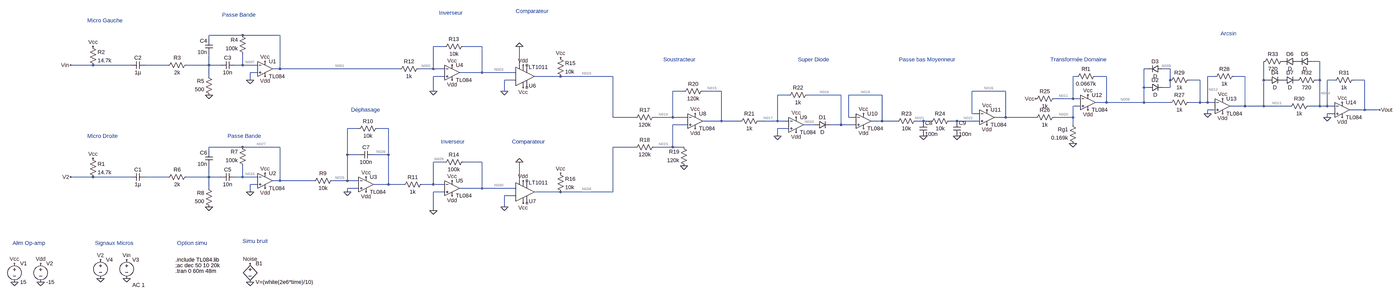
[diagram p0: schematic Récepteur.asc, whole sheet]
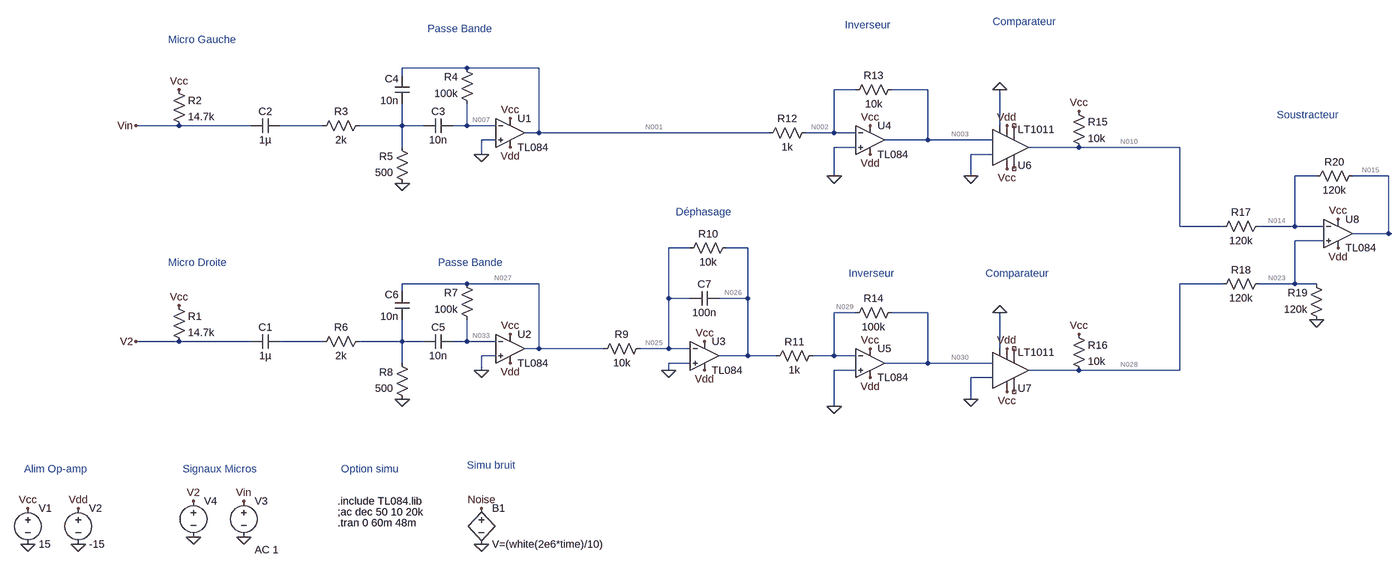
[diagram p1: schematic Récepteur.asc, part, row 1 of 1, column 1 of 2]
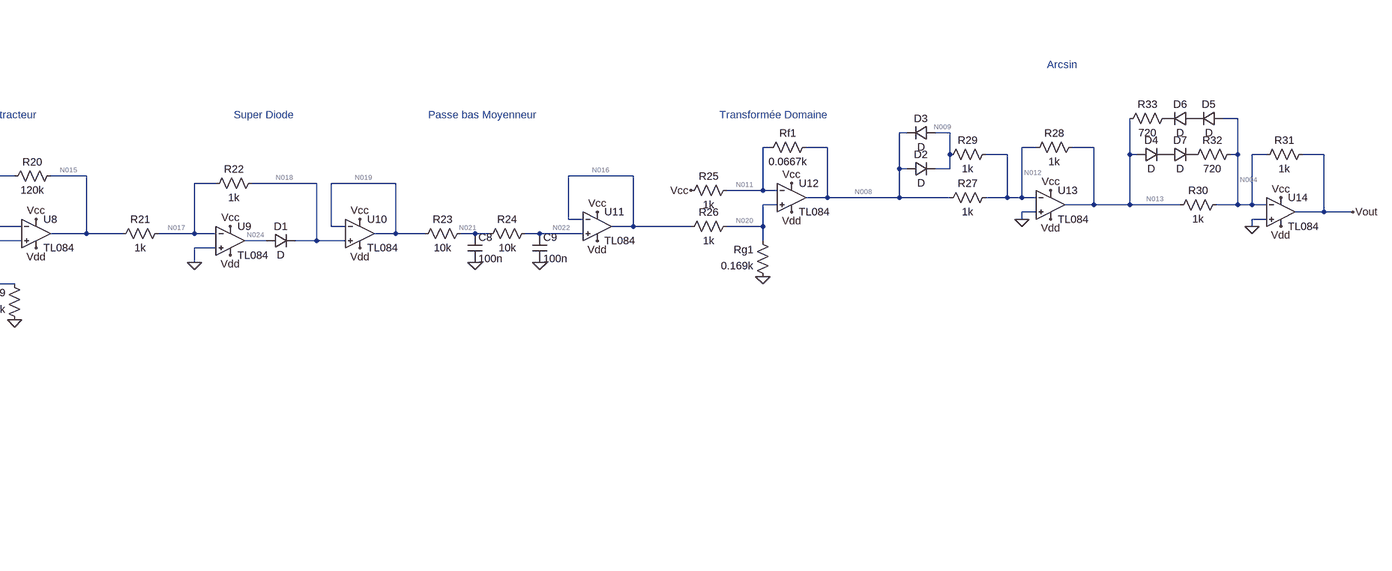
[diagram p2: schematic Récepteur.asc, part, row 1 of 1, column 2 of 2]
Récepteur.asc, the LTspice schematic file:
Version 4
SHEET 1 5480 844
WIRE 480 -368 336 -368
WIRE 640 -368 480 -368
WIRE 336 -352 336 -368
WIRE 1344 -320 1296 -320
WIRE 1504 -320 1424 -320
WIRE 5088 -256 5056 -256
WIRE -160 -240 -256 -240
WIRE 0 -240 -160 -240
WIRE 160 -240 64 -240
WIRE 336 -240 336 -288
WIRE 336 -240 240 -240
WIRE 384 -240 336 -240
WIRE 480 -240 480 -288
WIRE 480 -240 448 -240
WIRE 544 -240 480 -240
WIRE 1664 -240 1664 -320
WIRE 640 -224 640 -368
WIRE 640 -224 608 -224
WIRE 1152 -224 640 -224
WIRE 1296 -224 1296 -320
WIRE 1296 -224 1232 -224
WIRE 1344 -224 1296 -224
WIRE 4352 -224 4336 -224
WIRE 4448 -224 4416 -224
WIRE 544 -208 512 -208
WIRE 1504 -208 1504 -320
WIRE 1504 -208 1408 -208
WIRE 1648 -208 1504 -208
WIRE 336 -192 336 -240
WIRE 1344 -192 1296 -192
WIRE 1840 -192 1728 -192
WIRE 2064 -192 1840 -192
WIRE 4048 -192 4032 -192
WIRE 4176 -192 4128 -192
WIRE 4640 -192 4608 -192
WIRE 4768 -192 4720 -192
WIRE 512 -176 512 -208
WIRE 1648 -176 1600 -176
WIRE 4448 -176 4448 -224
WIRE 4576 -176 4528 -176
WIRE 4848 -176 4848 -256
WIRE 4864 -176 4848 -176
WIRE 5088 -176 5088 -256
WIRE 5088 -176 5072 -176
WIRE 5152 -176 5120 -176
WIRE 5280 -176 5232 -176
WIRE 4336 -144 4336 -224
WIRE 4352 -144 4336 -144
WIRE 4448 -144 4448 -176
WIRE 4448 -144 4416 -144
WIRE 1296 -128 1296 -192
WIRE 1600 -128 1600 -176
WIRE 2368 -128 2320 -128
WIRE 2528 -128 2448 -128
WIRE 3744 -128 3600 -128
WIRE 2816 -112 2768 -112
WIRE 3040 -112 2896 -112
WIRE 3216 -112 3072 -112
WIRE 4032 -96 4032 -192
WIRE 4032 -96 3952 -96
WIRE 4064 -96 4032 -96
WIRE 4176 -80 4176 -192
WIRE 4176 -80 4128 -80
WIRE 4336 -80 4336 -144
WIRE 4336 -80 4176 -80
WIRE 4448 -80 4336 -80
WIRE 4576 -80 4576 -176
WIRE 4576 -80 4528 -80
WIRE 4608 -80 4608 -192
WIRE 4608 -80 4576 -80
WIRE 4640 -80 4608 -80
WIRE 4064 -64 4032 -64
WIRE 4768 -64 4768 -192
WIRE 4768 -64 4704 -64
WIRE 4848 -64 4848 -176
WIRE 4848 -64 4768 -64
WIRE 4960 -64 4848 -64
WIRE 5088 -64 5088 -176
WIRE 5088 -64 5040 -64
WIRE 5120 -64 5120 -176
WIRE 5120 -64 5088 -64
WIRE 5152 -64 5120 -64
WIRE 4640 -48 4608 -48
WIRE 5280 -48 5280 -176
WIRE 5280 -48 5216 -48
WIRE 5344 -48 5280 -48
WIRE 3600 -32 3600 -128
WIRE 3632 -32 3600 -32
WIRE 4608 -32 4608 -48
WIRE 5152 -32 5120 -32
WIRE 2064 -16 2064 -192
WIRE 2160 -16 2064 -16
WIRE 2320 -16 2320 -128
WIRE 2320 -16 2240 -16
WIRE 2384 -16 2320 -16
WIRE 3072 -16 3072 -112
WIRE 3104 -16 3072 -16
WIRE 3744 -16 3744 -128
WIRE 3744 -16 3696 -16
WIRE 3872 -16 3744 -16
WIRE 4032 -16 4032 -64
WIRE 4032 -16 3952 -16
WIRE 5120 -16 5120 -32
WIRE 2528 0 2528 -128
WIRE 2528 0 2448 0
WIRE 2608 0 2528 0
WIRE 2768 0 2768 -112
WIRE 2768 0 2688 0
WIRE 2816 0 2768 0
WIRE 3216 0 3216 -112
WIRE 3216 0 3168 0
WIRE 3280 0 3216 0
WIRE 3392 0 3360 0
WIRE 3424 0 3392 0
WIRE 3536 0 3504 0
WIRE 3632 0 3536 0
WIRE 2384 16 2320 16
WIRE 2928 16 2880 16
WIRE 3040 16 3040 -112
WIRE 3040 16 2992 16
WIRE 3104 16 3040 16
WIRE 4032 16 4032 -16
WIRE 976 32 928 32
WIRE 1104 32 1056 32
WIRE 2816 32 2768 32
WIRE 2768 64 2768 32
WIRE 480 112 336 112
WIRE 640 112 480 112
WIRE 2160 112 2064 112
WIRE 2320 112 2320 16
WIRE 2320 112 2240 112
WIRE 2368 112 2320 112
WIRE 336 128 336 112
WIRE 928 144 928 32
WIRE 976 144 928 144
WIRE 1104 144 1104 32
WIRE 1104 144 1040 144
WIRE 1344 176 1296 176
WIRE 1504 176 1424 176
WIRE -160 240 -256 240
WIRE 0 240 -160 240
WIRE 160 240 64 240
WIRE 336 240 336 192
WIRE 336 240 240 240
WIRE 384 240 336 240
WIRE 480 240 480 192
WIRE 480 240 448 240
WIRE 544 240 480 240
WIRE 640 256 640 112
WIRE 640 256 608 256
WIRE 784 256 640 256
WIRE 928 256 928 144
WIRE 928 256 864 256
WIRE 976 256 928 256
WIRE 1664 256 1664 176
WIRE 544 272 512 272
WIRE 1104 272 1104 144
WIRE 1104 272 1040 272
WIRE 1168 272 1104 272
WIRE 1296 272 1296 176
WIRE 1296 272 1248 272
WIRE 1344 272 1296 272
WIRE 336 288 336 240
WIRE 976 288 928 288
WIRE 1504 288 1504 176
WIRE 1504 288 1408 288
WIRE 1648 288 1504 288
WIRE 512 304 512 272
WIRE 928 304 928 288
WIRE 1344 304 1296 304
WIRE 1840 304 1728 304
WIRE 2064 304 2064 112
WIRE 2064 304 1840 304
WIRE 1648 320 1600 320
WIRE 1600 368 1600 320
WIRE 1296 384 1296 304
FLAG -16 800 0
FLAG -496 816 0
FLAG -384 816 0
FLAG -384 736 Vdd
FLAG -496 736 Vcc
FLAG -16 720 Vin
FLAG 512 816 0
FLAG 512 736 Noise
FLAG -128 800 0
FLAG -128 720 V2
FLAG -160 -320 Vcc
FLAG -160 160 Vcc
FLAG 512 -176 0
FLAG 576 -256 Vcc
FLAG 576 -192 Vdd
FLAG 336 -112 0
FLAG 512 304 0
FLAG 576 224 Vcc
FLAG 576 288 Vdd
FLAG 336 368 0
FLAG 1008 240 Vcc
FLAG 1008 304 Vdd
FLAG 928 304 0
FLAG 1296 384 0
FLAG 1376 256 Vcc
FLAG 1376 -240 Vcc
FLAG 1376 -176 Vdd
FLAG 1376 320 Vdd
FLAG 1296 -128 0
FLAG 1600 -128 0
FLAG 1664 -320 0
FLAG 1680 -144 Vcc
FLAG 1680 -240 Vdd
FLAG 1840 -272 Vcc
FLAG 1600 368 0
FLAG 1664 176 0
FLAG 1680 352 Vcc
FLAG 1680 256 Vdd
FLAG 1840 224 Vcc
FLAG 2416 -32 Vcc
FLAG 2416 32 Vdd
FLAG 2368 192 0
FLAG 2848 -16 Vcc
FLAG 2848 48 Vdd
FLAG 2768 64 0
FLAG 3136 -32 Vcc
FLAG 3136 32 Vdd
FLAG 3392 64 0
FLAG 3536 64 0
FLAG 3664 -48 Vcc
FLAG 3664 16 Vdd
FLAG 4096 -112 Vcc
FLAG 4096 -48 Vdd
FLAG 3872 -96 Vcc
FLAG 4032 96 0
FLAG 4608 -32 0
FLAG 4672 -96 Vcc
FLAG 4672 -32 Vdd
FLAG 5120 -16 0
FLAG 5184 -80 Vcc
FLAG 5184 -16 Vdd
FLAG 5344 -48 Vout
FLAG -256 -240 Vin
FLAG -256 240 V2
SYMBOL voltage -496 720 R0
WINDOW 123 0 0 Left 0
WINDOW 39 0 0 Left 0
SYMATTR InstName V1
SYMATTR Value 15
SYMBOL voltage -384 720 R0
WINDOW 123 0 0 Left 0
WINDOW 39 0 0 Left 0
SYMATTR InstName V2
SYMATTR Value -15
SYMBOL voltage -16 704 R0
WINDOW 123 24 124 Left 2
WINDOW 39 0 0 Left 0
WINDOW 3 24 152 Invisible 2
SYMATTR Value2 AC 1
SYMATTR Value SINE(0.1 0.01 2.5k 0 0 0)
SYMATTR InstName V3
SYMBOL bv 512 720 R0
SYMATTR InstName B1
SYMATTR Value V=(white(2e6*time)/10)
SYMBOL voltage -128 704 R0
WINDOW 123 0 0 Left 0
WINDOW 39 0 0 Left 0
WINDOW 3 24 96 Invisible 2
SYMATTR Value SINE(0.1 0.01 2.5k 0 0)
SYMATTR InstName V4
SYMBOL res -176 144 R0
SYMATTR InstName R1
SYMATTR Value 14.7k
SYMBOL res -176 -336 R0
SYMATTR InstName R2
SYMATTR Value 14.7k
SYMBOL cap 64 224 R90
WINDOW 0 0 32 VBottom 2
WINDOW 3 32 32 VTop 2
SYMATTR InstName C1
SYMATTR Value 1µ
SYMBOL cap 64 -256 R90
WINDOW 0 0 32 VBottom 2
WINDOW 3 32 32 VTop 2
SYMATTR InstName C2
SYMATTR Value 1µ
SYMBOL res 256 -256 R90
WINDOW 0 0 56 VBottom 2
WINDOW 3 32 56 VTop 2
SYMATTR InstName R3
SYMATTR Value 2k
SYMBOL res 496 -272 R180
WINDOW 0 36 76 Left 2
WINDOW 3 36 40 Left 2
SYMATTR InstName R4
SYMATTR Value 100k
SYMBOL res 352 -96 R180
WINDOW 0 36 76 Left 2
WINDOW 3 36 40 Left 2
SYMATTR InstName R5
SYMATTR Value 500
SYMBOL cap 448 -256 R90
WINDOW 0 0 32 VBottom 2
WINDOW 3 32 32 VTop 2
SYMATTR InstName C3
SYMATTR Value 10n
SYMBOL cap 352 -288 R180
WINDOW 0 24 56 Left 2
WINDOW 3 24 8 Left 2
SYMATTR InstName C4
SYMATTR Value 10n
SYMBOL Opamps\\opamp2 576 -288 R0
SYMATTR InstName U1
SYMATTR Value TL084
SYMBOL res 256 224 R90
WINDOW 0 0 56 VBottom 2
WINDOW 3 32 56 VTop 2
SYMATTR InstName R6
SYMATTR Value 2k
SYMBOL res 496 208 R180
WINDOW 0 36 76 Left 2
WINDOW 3 36 40 Left 2
SYMATTR InstName R7
SYMATTR Value 100k
SYMBOL res 352 384 R180
WINDOW 0 36 76 Left 2
WINDOW 3 36 40 Left 2
SYMATTR InstName R8
SYMATTR Value 500
SYMBOL cap 448 224 R90
WINDOW 0 0 32 VBottom 2
WINDOW 3 32 32 VTop 2
SYMATTR InstName C5
SYMATTR Value 10n
SYMBOL cap 352 192 R180
WINDOW 0 24 56 Left 2
WINDOW 3 24 8 Left 2
SYMATTR InstName C6
SYMATTR Value 10n
SYMBOL Opamps\\opamp2 576 192 R0
SYMATTR InstName U2
SYMATTR Value TL084
SYMBOL res 880 240 R90
WINDOW 0 0 56 VBottom 2
WINDOW 3 32 56 VTop 2
SYMATTR InstName R9
SYMATTR Value 10k
SYMBOL res 1072 16 R90
WINDOW 0 0 56 VBottom 2
WINDOW 3 32 56 VTop 2
SYMATTR InstName R10
SYMATTR Value 10k
SYMBOL cap 1040 128 R90
WINDOW 0 0 32 VBottom 2
WINDOW 3 32 32 VTop 2
SYMATTR InstName C7
SYMATTR Value 100n
SYMBOL Opamps\\opamp2 1008 208 R0
SYMATTR InstName U3
SYMATTR Value TL084
SYMBOL Opamps\\opamp2 1376 -272 R0
SYMATTR InstName U4
SYMATTR Value TL084
SYMBOL Opamps\\opamp2 1376 224 R0
SYMATTR InstName U5
SYMATTR Value TL084
SYMBOL res 1248 -240 R90
WINDOW 0 0 56 VBottom 2
WINDOW 3 32 56 VTop 2
SYMATTR InstName R12
SYMATTR Value 1k
SYMBOL res 1264 256 R90
WINDOW 0 0 56 VBottom 2
WINDOW 3 32 56 VTop 2
SYMATTR InstName R11
SYMATTR Value 1k
SYMBOL res 1440 -336 R90
WINDOW 0 0 56 VBottom 2
WINDOW 3 32 56 VTop 2
SYMATTR InstName R13
SYMATTR Value 10k
SYMBOL res 1440 160 R90
WINDOW 0 0 56 VBottom 2
WINDOW 3 32 56 VTop 2
SYMATTR InstName R14
SYMATTR Value 100k
SYMBOL Comparators\\LT1011 1680 -192 M180
SYMATTR InstName U6
SYMBOL res 1824 -288 R0
SYMATTR InstName R15
SYMATTR Value 10k
SYMBOL Comparators\\LT1011 1680 304 M180
SYMATTR InstName U7
SYMBOL res 1824 208 R0
SYMATTR InstName R16
SYMATTR Value 10k
SYMBOL res 2256 -32 R90
WINDOW 0 0 56 VBottom 2
WINDOW 3 32 56 VTop 2
SYMATTR InstName R17
SYMATTR Value 120k
SYMBOL res 2256 96 R90
WINDOW 0 0 56 VBottom 2
WINDOW 3 32 56 VTop 2
SYMATTR InstName R18
SYMATTR Value 120k
SYMBOL Opamps\\opamp2 2416 -64 R0
SYMATTR InstName U8
SYMATTR Value TL084
SYMBOL res 2384 208 R180
WINDOW 0 36 76 Left 2
WINDOW 3 36 40 Left 2
SYMATTR InstName R19
SYMATTR Value 120k
SYMBOL res 2464 -144 R90
WINDOW 0 0 56 VBottom 2
WINDOW 3 32 56 VTop 2
SYMATTR InstName R20
SYMATTR Value 120k
SYMBOL res 2704 -16 R90
WINDOW 0 0 56 VBottom 2
WINDOW 3 32 56 VTop 2
SYMATTR InstName R21
SYMATTR Value 1k
SYMBOL res 2912 -128 R90
WINDOW 0 0 56 VBottom 2
WINDOW 3 32 56 VTop 2
SYMATTR InstName R22
SYMATTR Value 1k
SYMBOL Opamps\\opamp2 2848 -48 R0
SYMATTR InstName U9
SYMATTR Value TL084
SYMBOL diode 2928 32 R270
WINDOW 0 32 32 VTop 2
WINDOW 3 0 32 VBottom 2
SYMATTR InstName D1
SYMBOL Opamps\\opamp2 3136 -64 R0
SYMATTR InstName U10
SYMATTR Value TL084
SYMBOL res 3376 -16 R90
WINDOW 0 0 56 VBottom 2
WINDOW 3 32 56 VTop 2
SYMATTR InstName R23
SYMATTR Value 10k
SYMBOL res 3520 -16 R90
WINDOW 0 0 56 VBottom 2
WINDOW 3 32 56 VTop 2
SYMATTR InstName R24
SYMATTR Value 10k
SYMBOL cap 3376 0 R0
SYMATTR InstName C8
SYMATTR Value 100n
SYMATTR SpiceLine V=4 Irms=0 Rser=0 Lser=0
SYMBOL cap 3520 0 R0
SYMATTR InstName C9
SYMATTR Value 100n
SYMBOL Opamps\\opamp2 3664 -80 R0
SYMATTR InstName U11
SYMATTR Value TL084
SYMBOL res 3968 -112 R90
WINDOW 0 0 56 VBottom 2
WINDOW 3 32 56 VTop 2
SYMATTR InstName R25
SYMATTR Value 1k
SYMBOL res 3968 -32 R90
WINDOW 0 0 56 VBottom 2
WINDOW 3 32 56 VTop 2
SYMATTR InstName R26
SYMATTR Value 1k
SYMBOL res 4144 -208 R90
WINDOW 0 0 56 VBottom 2
WINDOW 3 32 56 VTop 2
SYMATTR InstName Rf1
SYMATTR Value 0.0667k
SYMBOL res 4048 112 R180
WINDOW 0 36 76 Left 2
WINDOW 3 36 40 Left 2
SYMATTR InstName Rg1
SYMATTR Value 0.169k
SYMBOL Opamps\\opamp2 4096 -144 R0
SYMATTR InstName U12
SYMATTR Value TL084
SYMBOL res 4544 -96 R90
WINDOW 0 0 56 VBottom 2
WINDOW 3 32 56 VTop 2
SYMATTR InstName R27
SYMATTR Value 1k
SYMBOL res 4736 -208 R90
WINDOW 0 0 56 VBottom 2
WINDOW 3 32 56 VTop 2
SYMATTR InstName R28
SYMATTR Value 1k
SYMBOL res 4544 -192 R90
WINDOW 0 0 56 VBottom 2
WINDOW 3 32 56 VTop 2
SYMATTR InstName R29
SYMATTR Value 1k
SYMBOL Opamps\\opamp2 4672 -128 R0
SYMATTR InstName U13
SYMATTR Value TL084
SYMBOL diode 4352 -128 R270
WINDOW 0 32 32 VTop 2
WINDOW 3 0 32 VBottom 2
SYMATTR InstName D2
SYMBOL diode 4416 -240 R90
WINDOW 0 0 32 VBottom 2
WINDOW 3 32 32 VTop 2
SYMATTR InstName D3
SYMBOL res 5056 -80 R90
WINDOW 0 0 56 VBottom 2
WINDOW 3 32 56 VTop 2
SYMATTR InstName R30
SYMATTR Value 1k
SYMBOL res 5248 -192 R90
WINDOW 0 0 56 VBottom 2
WINDOW 3 32 56 VTop 2
SYMATTR InstName R31
SYMATTR Value 1k
SYMBOL Opamps\\opamp2 5184 -112 R0
SYMATTR InstName U14
SYMATTR Value TL084
SYMBOL diode 4864 -160 R270
WINDOW 0 32 32 VTop 2
WINDOW 3 0 32 VBottom 2
SYMATTR InstName D4
SYMBOL diode 5056 -272 R90
WINDOW 0 0 32 VBottom 2
WINDOW 3 32 32 VTop 2
SYMATTR InstName D5
SYMBOL diode 4992 -272 R90
WINDOW 0 0 32 VBottom 2
WINDOW 3 32 32 VTop 2
SYMATTR InstName D6
SYMBOL diode 4928 -160 R270
WINDOW 0 32 32 VTop 2
WINDOW 3 0 32 VBottom 2
SYMATTR InstName D7
SYMBOL res 5088 -192 R90
WINDOW 0 0 56 VBottom 2
WINDOW 3 32 56 VTop 2
SYMATTR InstName R32
SYMATTR Value 720
SYMBOL res 4944 -272 R90
WINDOW 0 0 56 VBottom 2
WINDOW 3 32 56 VTop 2
SYMATTR InstName R33
SYMATTR Value 720
TEXT 192 744 Left 2 !;ac dec 50 10 20k
TEXT 192 768 Left 2 !.tran 0 60m 48m
TEXT 192 720 Left 2 !.include TL084.lib
TEXT -504 648 Left 2 ;Alim Op-amp
TEXT -152 648 Left 2 ;Signaux Micros
TEXT 200 648 Left 2 ;Option simu
TEXT 480 640 Left 2 ;Simu bruit
TEXT 392 -456 Left 2 ;Passe Bande
TEXT 416 64 Left 2 ;Passe Bande
TEXT -184 -432 Left 2 ;Micro Gauche
TEXT -184 64 Left 2 ;Micro Droite
TEXT 944 -48 Left 2 ;Déphasage
TEXT 1320 -464 Left 2 ;Inverseur
TEXT 1328 88 Left 2 ;Inverseur
TEXT 1648 -472 Left 2 ;Comparateur
TEXT 1632 88 Left 2 ;Comparateur
TEXT 2280 -264 Left 2 ;Soustracteur
TEXT 2856 -264 Left 2 ;Super Diode
TEXT 3288 -264 Left 2 ;Passe bas Moyenneur
TEXT 3936 -264 Left 2 ;Transformée Domaine
TEXT 4664 -376 Left 2 ;Arcsin

The netlist it stands for:
* Récepteur.asc
V1 Vcc 0 15
V2 Vdd 0 -15
V3 Vin 0 SINE(0.1 0.01 2.5k 0 0 0) AC 1
B1 Noise 0 V=(white(2e6*time)/10)
V4 V2 0 SINE(0.1 0.01 2.5k 0 0)
R1 Vcc V2 14.7k
R2 Vcc Vin 14.7k
C1 N031 V2 1µ
C2 N005 Vin 1µ
R3 N006 N005 2k
R4 N007 N001 100k
R5 0 N006 500
C3 N007 N006 10n
C4 N006 N001 10n
XU1 0 N007 Vcc Vdd N001 TL084  ; pins In+ In- V+ V- OUT
R6 N032 N031 2k
R7 N033 N027 100k
R8 0 N032 500
C5 N033 N032 10n
C6 N032 N027 10n
XU2 0 N033 Vcc Vdd N027 TL084  ; pins In+ In- V+ V- OUT
R9 N025 N027 10k
R10 N026 N025 10k
C7 N026 N025 100n
XU3 0 N025 Vcc Vdd N026 TL084  ; pins In+ In- V+ V- OUT
XU4 0 N002 Vcc Vdd N003 TL084  ; pins In+ In- V+ V- OUT
XU5 0 N029 Vcc Vdd N030 TL084  ; pins In+ In- V+ V- OUT
R12 N002 N001 1k
R11 N029 N026 1k
R13 N003 N002 10k
R14 N030 N029 100k
XU6 0 N003 0 Vdd NC_01 NC_02 N010 Vcc LT1011
R15 Vcc N010 10k
XU7 0 N030 0 Vdd NC_03 NC_04 N028 Vcc LT1011
R16 Vcc N028 10k
R17 N014 N010 120k
R18 N023 N028 120k
XU8 N023 N014 Vcc Vdd N015 TL084  ; pins In+ In- V+ V- OUT
R19 0 N023 120k
R20 N015 N014 120k
R21 N017 N015 1k
R22 N018 N017 1k
XU9 0 N017 Vcc Vdd N024 TL084  ; pins In+ In- V+ V- OUT
D1 N024 N018 D
XU10 N018 N019 Vcc Vdd N019 TL084  ; pins In+ In- V+ V- OUT
R23 N021 N019 10k
R24 N022 N021 10k
C8 N021 0 100n V=4 Irms=0 Rser=0 Lser=0
C9 N022 0 100n
XU11 N022 N016 Vcc Vdd N016 TL084  ; pins In+ In- V+ V- OUT
R25 N011 Vcc 1k
R26 N020 N016 1k
Rf1 N008 N011 0.0667k
Rg1 0 N020 0.169k
XU12 N020 N011 Vcc Vdd N008 TL084  ; pins In+ In- V+ V- OUT
R27 N012 N008 1k
R28 N013 N012 1k
R29 N012 N009 1k
XU13 0 N012 Vcc Vdd N013 TL084  ; pins In+ In- V+ V- OUT
D2 N008 N009 D
D3 N009 N008 D
R30 N004 N013 1k
R31 Vout N004 1k
XU14 0 N004 Vcc Vdd Vout TL084  ; pins In+ In- V+ V- OUT
D4 N013 P001 D
D5 N004 P002 D
D6 P002 P003 D
D7 P001 P004 D
R32 N004 P004 720
R33 P003 N013 720
.model D D
.lib standard.dio
;ac dec 50 10 20k
.tran 0 60m 48m
.include TL084.lib
* Alim Op-amp
* Signaux Micros
* Option simu
* Simu bruit
* Passe Bande
* Passe Bande
* Micro Gauche
* Micro Droite
* Déphasage
* Inverseur
* Inverseur
* Comparateur
* Comparateur
* Soustracteur
* Super Diode
* Passe bas Moyenneur
* Transformée Domaine
* Arcsin
.lib LTC1.lib
.backanno
.end

* Results of the author's LTspice run, read from the files saved beside the schematic
* Operating Point, zero values left out:
*   V(vcc) = 15 V
*   V(vdd) = -15 V
*   V(vin) = 100 mV
*   V(v2) = 100 mV
*   V(n007) = 10.97 µV
*   V(n001) = 15.48 µV
*   V(n033) = 10.97 µV
*   V(n027) = 15.48 µV
*   V(n025) = 10.97 µV
*   V(n026) = 6.916 µV
*   V(n003) = -33.63 µV
*   V(n002) = 10.97 µV
*   V(n030) = 420.8 µV
*   V(n029) = 10.97 µV
*   V(n010) = 166.9 mV
*   V(n028) = 14.4 V
*   V(n014) = 6.815 V
*   V(n023) = 7.2 V
*   V(n015) = 13.46 V
*   V(n017) = 13.46 V
*   V(n018) = 13.46 V
*   V(n024) = -13.48 V
*   V(n019) = 13.41 V
*   V(n021) = 13.41 V
*   V(n022) = 13.41 V
*   V(n016) = 13.39 V
*   V(n011) = 1.936 V
*   V(n020) = 1.936 V
*   V(n008) = 1.064 V
*   V(n012) = 21.85 µV
*   V(n013) = -1.495 V
*   V(n009) = 431 mV
*   V(n004) = 589.5 nV
*   V(vout) = 1.831 V
*   V(p001) = -747.6 mV
*   V(p002) = -626.9 mV
*   V(p003) = -1.254 V
*   V(p004) = 588.9 nV
*   I(D6) = 335.4 µA
*   I(D5) = 335.4 µA
*   I(D2) = 430.9 µA
*   I(D1) = -26.95 pA
*   I(R33) = 335.4 µA
*   I(R31) = 1.831 mA
*   I(R30) = 1.495 mA
*   I(R29) = -430.9 µA
*   I(R28) = -1.495 mA
*   I(R27) = -1.064 mA
*   I(Rg1) = -11.45 mA
*   I(Rf1) = -13.06 mA
*   I(R26) = -11.45 mA
*   I(R25) = -13.06 mA
*   I(R24) = -58.53 pA
*   I(R23) = -58.53 pA
*   I(R22) = -85.56 pA
*   I(R21) = -157.6 pA
*   I(R20) = 55.4 µA
*   I(R19) = -60 µA
*   I(R18) = -60 µA
*   I(R17) = 55.4 µA
*   I(R16) = 60.01 µA
*   I(R15) = 1.483 mA
*   I(R14) = 4.098 nA
*   I(R13) = -4.46 nA
*   I(R11) = 4.053 nA
*   I(R12) = -4.505 nA
*   I(R10) = -405.5 pA
*   I(R9) = -450.5 pA
*   I(R7) = -45.05 pA
*   I(R4) = -45.05 pA
*   I(R2) = 1.014 mA
*   I(R1) = 1.014 mA
*   I(V4) = 1.014 mA
*   I(V3) = 1.014 mA
*   I(V2) = 173.5 mA
*   I(V1) = -191.8 mA